# EAGLE design PSoC4Proto_Thermo (EAGLE 7.2.0)
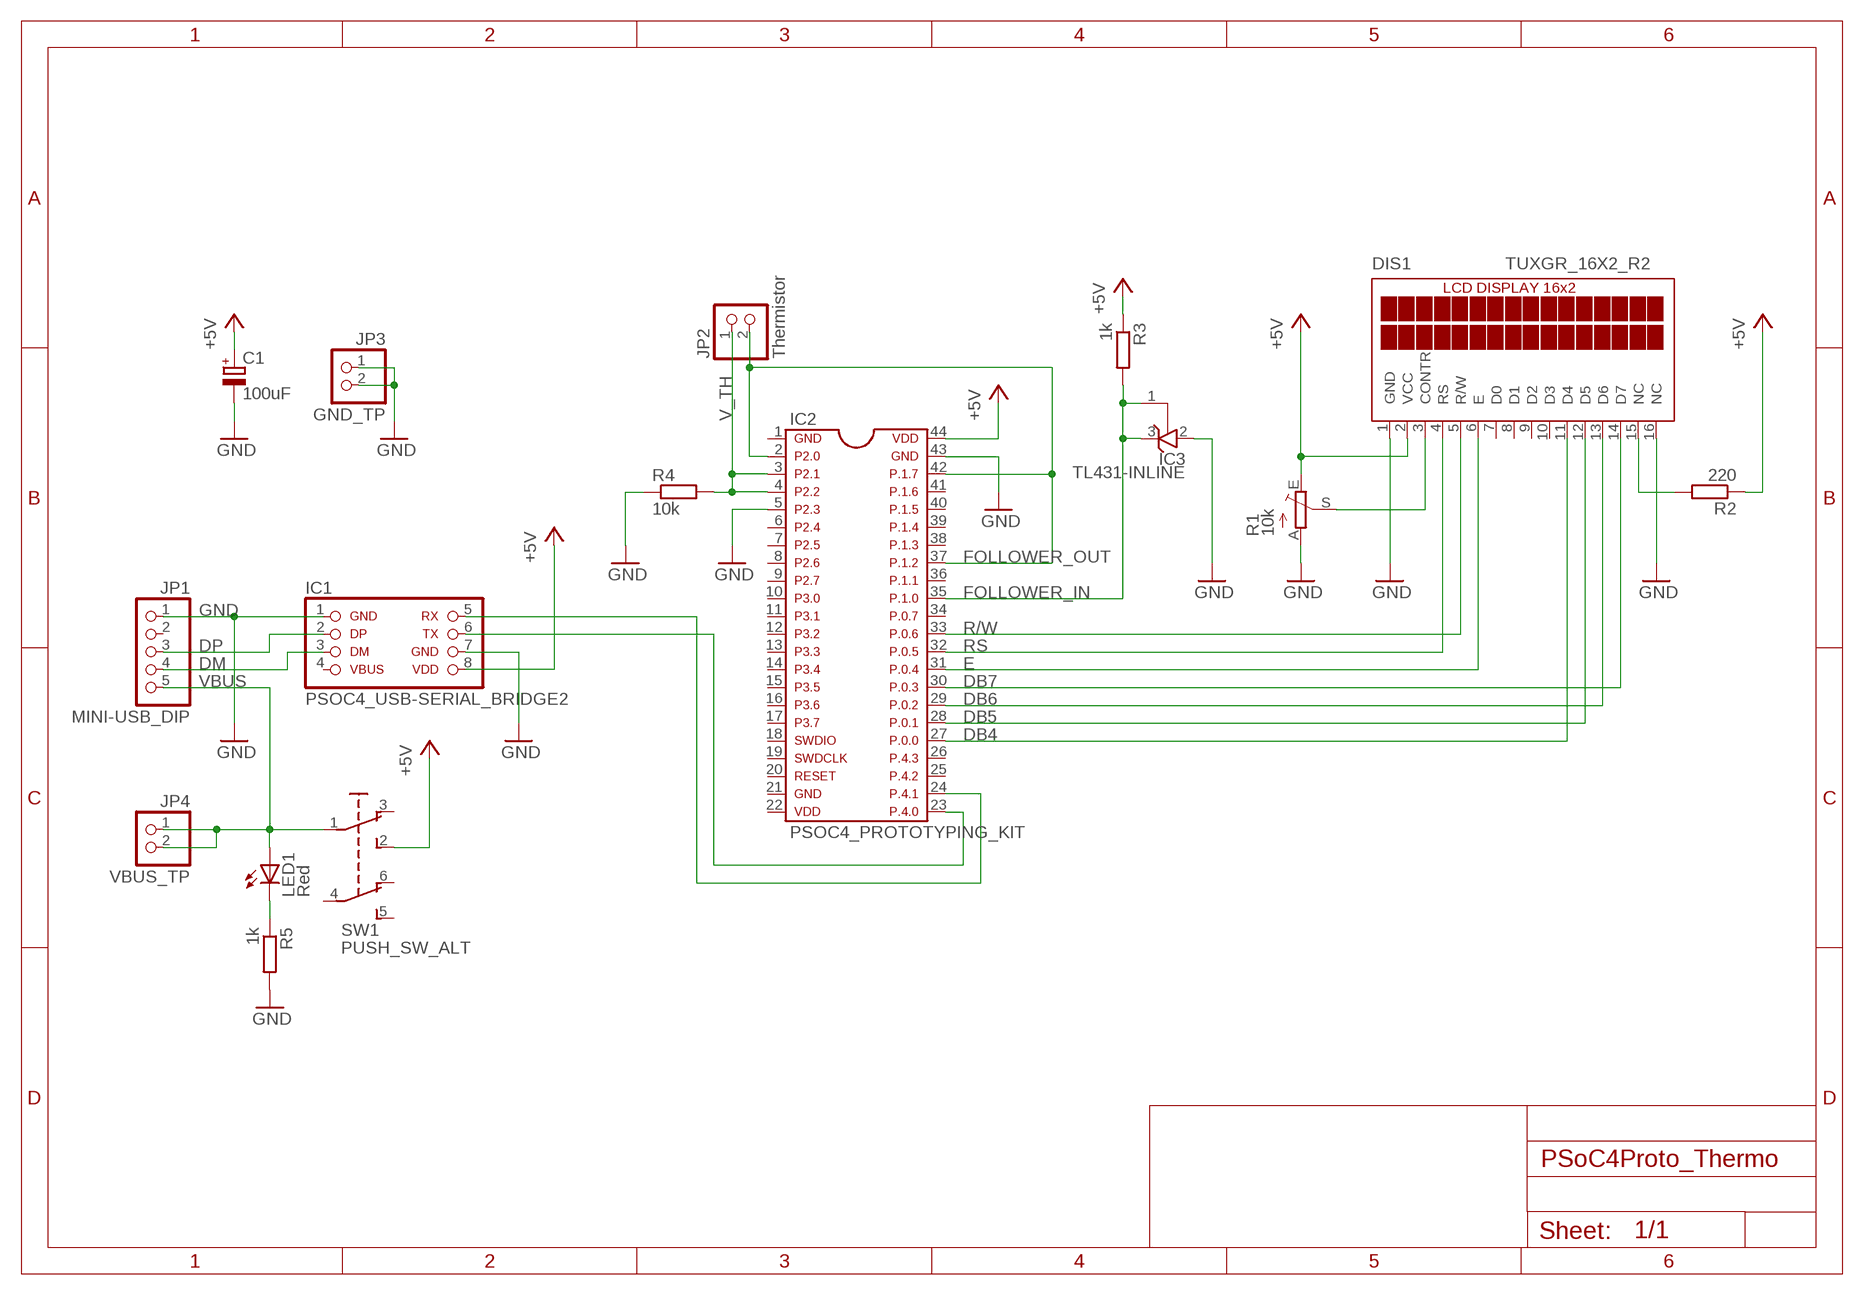
[diagram p0: schematic, sheet 1]

## Parts
C1  100uF  CPOL-EUE2.5-7  [E2,5-7]
DIS1  TUXGR_16X2_R2  [TUXGR_16X2_R2]
IC1  PSOC4_USB-SERIAL_BRIDGE2  [PSOC4-PROTO_USB-SERIAL_BRIDGE]
IC2  PSOC4_PROTOTYPING_KIT  [DIL44-8]
IC3  TL431-INLINE  [TO226AA]
JP1  MINI-USB_DIP  [MINI-USB_DIP]
JP2  Thermistor  PINHD-1X2  [1X02]
JP3  GND_TP  PINHD-1X2  [1X02]
JP4  VBUS_TP  PINHD-1X2  [1X02]
LED1  Red  LED3MM  [LED3MM]
R1  10k  TRIM_EU-B25P  [B25P]
R2  220  R-EU_0207/7  [0207/7]
R3  1k  R-EU_0207/7  [0207/7]
R4  10k  R-EU_0207/7  [0207/7]
R5  1k  R-EU_0207/7  [0207/7]
SW1  PUSH_SW_ALT  [PUSH_SW_ALT]

## Nets
+5V: C1.+ DIS1.2(VCC) IC1.8 IC2.44 R1.E R2.1 R3.1 SW1.2(S)
DB4: DIS1.11(D4) IC2.27
DB5: DIS1.12(D5) IC2.28
DB6: DIS1.13(D6) IC2.29
DB7: DIS1.14(D7) IC2.30
DM: IC1.3 JP1.4
DP: IC1.2 JP1.3
E: DIS1.6(E) IC2.31
FOLLOWER_IN: IC2.35 IC3.1(R) IC3.3(C) R3.2
FOLLOWER_OUT: IC2.2 IC2.37 IC2.42 JP2.2
GND: C1.- DIS1.1(GND) DIS1.16(NC) IC1.1 IC1.7 IC2.5 IC2.43 IC3.2(A) JP1.1 JP3.1 JP3.2 R1.A R4.1 R5.2
N$1: DIS1.15(NC) R2.2
N$2: DIS1.3(CONTR) R1.S
N$3: LED1.K(C) R5.1
R/W: DIS1.5(R/W) IC2.33
RS: DIS1.4(RS) IC2.32
RX: IC1.5 IC2.24
TX: IC1.6 IC2.23
V_TH: IC2.3 IC2.4 JP2.1 R4.2
VBUS: JP1.5 JP4.1 JP4.2 LED1.A SW1.1(P)
Unconnected: DIS1.7(D0) DIS1.8(D1) DIS1.9(D2) DIS1.10(D3) IC1.4 IC2.1 IC2.6 IC2.7 IC2.8 IC2.9 IC2.10 IC2.11 IC2.12 IC2.13 IC2.14 IC2.15 IC2.16 IC2.17 IC2.18 IC2.19 IC2.20 IC2.21 IC2.22 IC2.25 IC2.26 IC2.34 IC2.36 IC2.38 IC2.39 IC2.40 IC2.41 JP1.2 SW1.3(O) SW1.4(P1) SW1.5(S1) SW1.6(O1)

## Library data of the parts
C1 = rcl:CPOL-EU: POLARIZED CAPACITOR, European symbol
DIS1 = display-lcd:TUXGR_16X2_R2: Tuxgraphics LCD display 16x2 characters reflective, without background light Source: tuxgr_12x2_r2.pdf; OC_FARNELL: unknown; OC_NEWARK: unknown
IC1 = mylib2:PSOC4_USB-SERIAL_BRIDGE2
IC2 = mylib2:PSOC4_PROTOTYPING_KIT: Cypress PSoC 4 Prototyping Kit
IC3 = mylib2:TL431-INLINE
JP1 = mylib2:MINI-USB_DIP
JP2-JP4 = pinhead:PINHD-1X2: PIN HEADER
LED1 = led:LED: LED OSRAM: - CHIPLED LG R971, LG N971, LY N971, LG Q971, LY Q971, LO R971, LY R971 LH N974, LH R974 LS Q976, LO Q976, LY Q976 LO Q996 - Hyper CHIPLED LW Q18S LB Q993, LB Q99A, LB R99A - SideLED LS A670, LO A670, LY A670, LG A670, LP A670 LB A673, LV A673, LT A673, LW A673 LH A674 LY A675 LS A676, LA A676, LO A676, LY A676, LW A676 LS A679, LY A679, LG A679 - Hyper Micro SIDELED® LS Y876, LA Y876, LO Y876, LY Y876 LT Y87S - SmartLED LW L88C, LW L88S LB L89C, LB L89S, LG L890 LS L89K, LO L89K, LY L89K LS L896, LA L896, LO L896, LY L896 - TOPLED LS T670, LO T670, LY T670, LG T670, LP T670 LSG T670, LSP T670, LSY T670, LOP T670, LYG T670 LG T671, LOG T671, LSG T671 LB T673, LV T673, LT T673, LW T673 LH T674 LS T676, LA T676, LO T676, LY T676, LB T676, LH T676, LSB T676, LW T676 LB T67C, LV T67C, LT T67C, LS T67K, LO T67K, LY T67K, LW E67C LS E67B, LA E67B, LO E67B, LY E67B, LB E67C, LV E67C, LT E67C LW T67C LS T679, LY T679, LG T679 LS T770, LO T770, LY T770, LG T770, LP T770 LB T773, LV T773, LT T773, LW T773 LH T774 LS E675, LA E675, LY E675, LS T675 LS T776, LA T776, LO T776, LY T776, LB T776 LHGB T686 LT T68C, LB T68C - Hyper Mini TOPLED® LB M676 - Mini TOPLED Santana® LG M470 LS M47K, LO M47K, LY M47K Source: http://www.osram.convergy.de LUXEON: - LUMILED® LXK2-PW12-R00, LXK2-PW12-S00, LXK2-PW14-U00, LXK2-PW14-V00 LXK2-PM12-R00, LXK2-PM12-S00, LXK2-PM14-U00 LXK2-PE12-Q00, LXK2-PE12-R00, LXK2-PE12-S00, LXK2-PE14-T00, LXK2-PE14-U00 LXK2-PB12-K00, LXK2-PB12-L00, LXK2-PB12-M00, LXK2-PB14-N00, LXK2-PB14-P00, LXK2-PB14-Q00 LXK2-PR12-L00, LXK2-PR12-M00, LXK2-PR14-Q00, LXK2-PR14-R00 LXK2-PD12-Q00, LXK2-PD12-R00, LXK2-PD12-S00 LXK2-PH12-R00, LXK2-PH12-S00 LXK2-PL12-P00, LXK2-PL12-Q00, LXK2-PL12-R00 Source: www.luxeon.com KINGBRIGHT: KA-3528ASYC Source: www.kingbright.com
R1 = pot:TRIM_EU-: POTENTIOMETER
R2-R5 = rcl:R-EU_: RESISTOR, European symbol
SW1 = mylib2:PUSH_SW_ALT

## Board
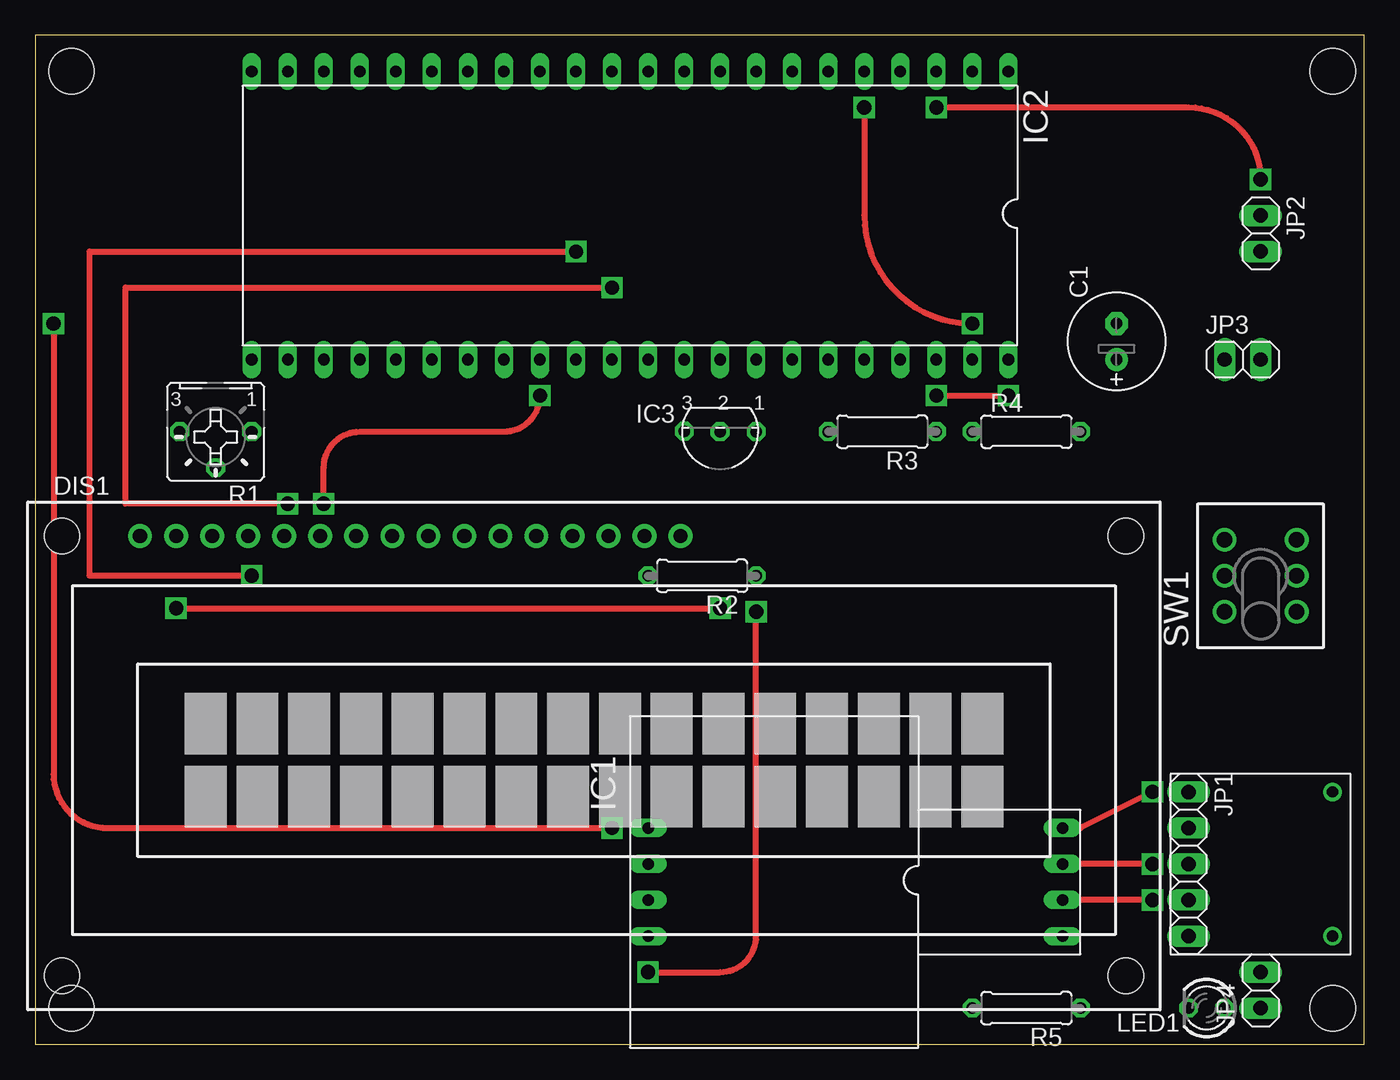
[diagram p1: board, top side]
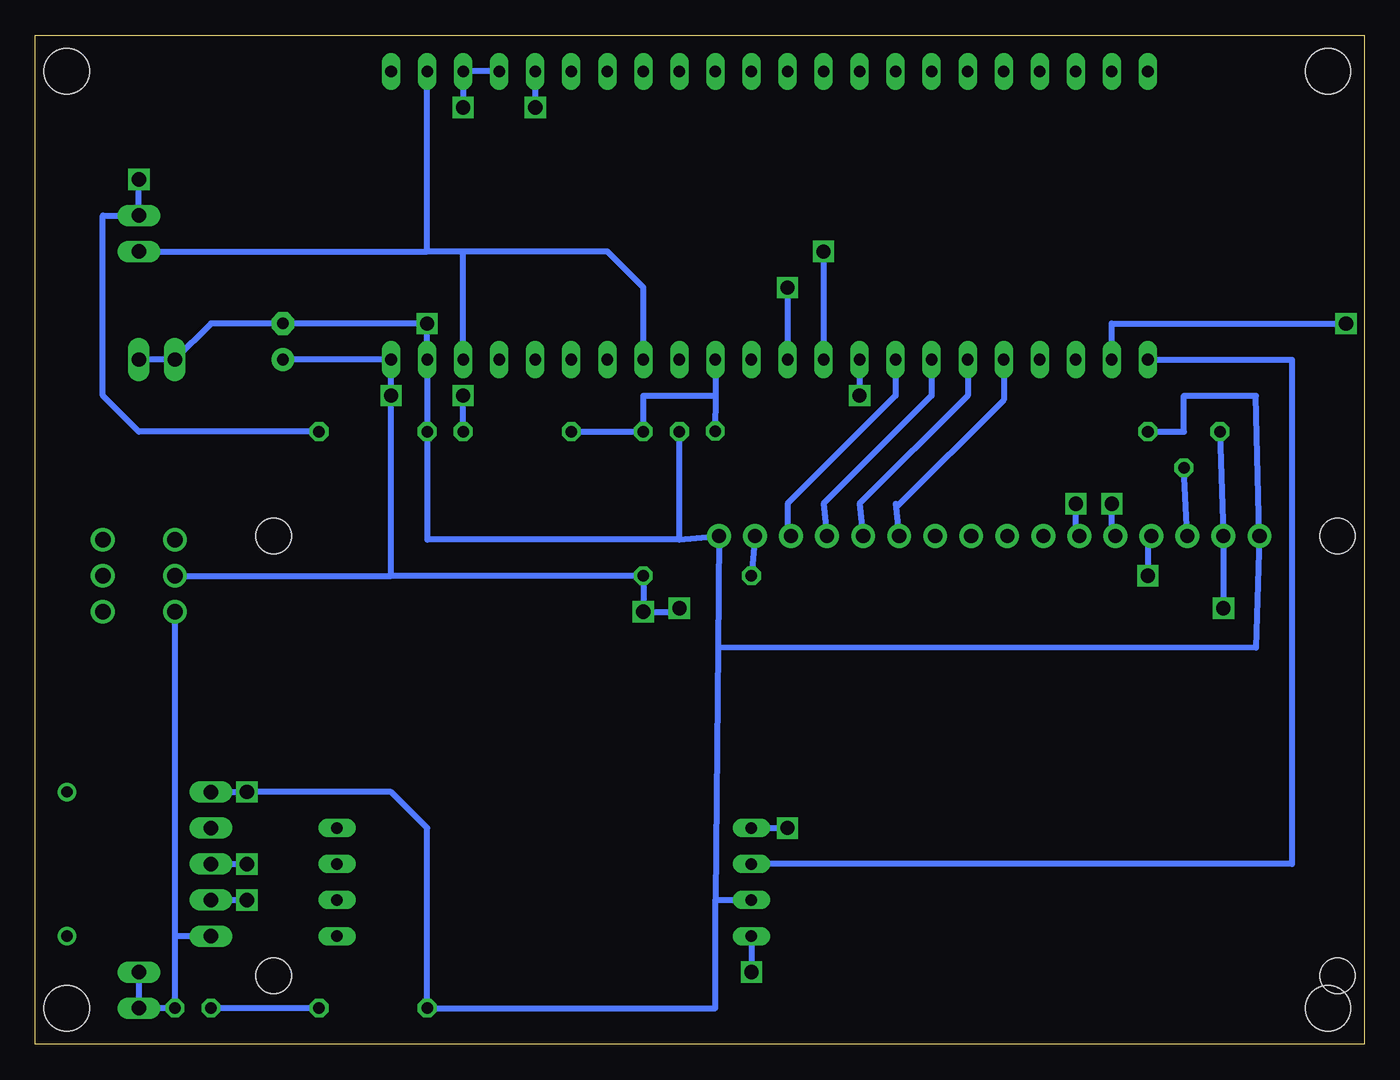
[diagram p2: board, bottom side, seen from below]

Size 93.65 x 71.11 mm. Coordinates in mm from the lower left corner, seen from the top.
Outline: 0,0 93.65,0 93.65,71.11 0,71.11 0,0
Copper layers (1*16): Top 0.035mm / dielectric 1.5mm / Bottom 0.035mm
Design rules "default": minimum track width 10mil, minimum drill 24mil, track to track 8mil, track to pad 8mil, pad to pad 8mil, via to via 8mil, smd to smd 8mil, copper to edge 40mil, drill to drill 8mil, minimum pad ring 10mil, minimum via ring 8mil, stop-mask expansion 4mil, vias tented up to drill 0mil, thermal gap 10mil
Holes 3.2 mm at 2.54,68.58 91.44,68.58 91.44,2.54 2.54,2.54

### Footprints (pad centres in the part's own frame; a part is rotated, then mirrored left to right if it is on the bottom)
E2,5-7 = drill 0.813 pad 1.6: + -1.27,0 | drill 0.813 pad 1.6 octagon: - 1.27,0
TUXGR_16X2_R2 = drill 1 pad 1.676: 1 -32,15.5; 2 -29.46,15.5; 3 -26.92,15.5; 4 -24.38,15.5; 5 -21.84,15.5; 6 -19.3,15.5; 7 -16.76,15.5; 8 -14.22,15.5; 9 -11.68,15.5; 10 -9.14,15.5; 11 -6.6,15.5; 12 -4.06,15.5; 13 -1.52,15.5; 14 1.02,15.5; 15 3.56,15.5; 16 6.1,15.5 | hole 2.5: -37.5,-15.5; 37.5,-15.5; -37.5,15.5; 37.5,15.5
PSOC4-PROTO_USB-SERIAL_BRIDGE = drill 0.813 long: 1 -21.59,-3.81; 2 -21.59,-1.27; 3 -21.59,1.27; 4 -21.59,3.81; 5 7.62,-3.81; 6 7.62,-1.27; 7 7.62,1.27; 8 7.62,3.81
DIL44-8 = drill 0.813 long: 1 -26.67,-7.62; 2 -24.13,-7.62; 3 -21.59,-7.62; 4 -19.05,-7.62; 5 -16.51,-7.62; 6 -13.97,-7.62; 7 -11.43,-7.62; 8 -8.89,-7.62; 9 -6.35,-7.62; 10 -3.81,-7.62; 11 -1.27,-7.62; 12 1.27,-7.62; 13 3.81,-7.62; 14 6.35,-7.62; 15 8.89,-7.62; 16 11.43,-7.62; 17 13.97,-7.62; 18 16.51,-7.62; 19 19.05,-7.62; 20 21.59,-7.62; 21 24.13,-7.62; 22 26.67,-7.62; 23 26.67,12.7; 24 24.13,12.7; 25 21.59,12.7; 26 19.05,12.7; 27 16.51,12.7; 28 13.97,12.7; 29 11.43,12.7; 30 8.89,12.7; 31 6.35,12.7; 32 3.81,12.7; 33 1.27,12.7; 34 -1.27,12.7; 35 -3.81,12.7; 36 -6.35,12.7; 37 -8.89,12.7; 38 -11.43,12.7; 39 -13.97,12.7; 40 -16.51,12.7; 41 -19.05,12.7; 42 -21.59,12.7; 43 -24.13,12.7; 44 -26.67,12.7
TO226AA = drill 0.813 octagon: 1 -2.544,0; 2 0.001,0; 3 2.524,-0.04
MINI-USB_DIP = drill 1.016 long: 1 -5.08,0; 2 -2.54,0; 3 0,0; 4 2.54,0; 5 5.08,0 | drill 0.8: P$1 -5.08,10.16; P$2 5.08,10.16
1X02 = drill 1.016 long: 1 -1.27,0; 2 1.27,0
LED3MM = drill 0.813 octagon: A -1.27,0; K 1.27,0
B25P = drill 0.813 octagon: A -2.54,0; E 2.54,0; S 0,2.54
0207/7 = drill 0.813 octagon: 1 -3.81,0; 2 3.81,0
PUSH_SW_ALT = drill 1.1 pad 1.676: 1 -2.54,2.54; 2 0,2.54; 3 2.54,2.54; 4 -2.54,-2.54; 5 0,-2.54; 6 2.54,-2.54

### Placement (x,y rotation side)
C1  76.2,49.53 90 top
DIS1  39.37,20.32 0 top
IC1  50.8,11.43 180 top
IC2  41.91,60.96 180 top
IC3  48.26,43.18 180 top
JP1  81.28,12.7 270 top
JP2  86.36,57.15 270 top
JP3  85.09,48.26 0 top
JP4  86.36,3.81 90 top
LED1  82.55,2.54 180 top
R1  12.7,43.18 180 top
R2  46.99,33.02 180 top
R3  59.69,43.18 180 top
R4  69.85,43.18 0 top
R5  69.85,2.54 180 top
SW1  86.36,33.02 90 top

### Tracks (layer width: path | path; a pad name or v marks a point on that pad's centre or on a via)
+5V  (via drill 1)
  Top 0.406: v63.5,45.72 v68.58,45.72 | v43.18,5.08 48.26,5.08 arc90 50.8,7.62 v50.8,30.48 | v9.91,30.73 v48.26,30.73
  Bottom 0.406: R1.E DIS1.2 v9.91,30.73 | 68.58,33.02 R2.1 v50.8,30.48 48.51,30.48 arc-90 v48.26,30.73 | 68.58,33.02 v68.58,45.72 IC2.44 C1.+ | R3.1 v63.5,45.72 | IC1.8 v43.18,5.08 | SW1.2 68.58,33.02
DB4
  Bottom 0.406: 33.02,38.1 32.99,37.83 | 32.99,37.83 DIS1.11 | IC2.27 25.4,45.41 32.99,37.83
DB5
  Bottom 0.406: DIS1.12 35.56,38.1 27.94,45.72 IC2.28
DB6
  Bottom 0.406: DIS1.13 38.1,38.1 30.48,45.72 IC2.29
DB7
  Bottom 0.406: IC2.30 33.02,45.72 40.64,38.1 40.64,36.07 DIS1.14
DM  (via drill 1)
  Top 0.406: v78.74,10.16 IC1.3
  Bottom 0.406: JP1.4 v78.74,10.16
DP  (via drill 1)
  Top 0.406: v78.74,12.7 IC1.2
  Bottom 0.406: JP1.3 v78.74,12.7
E  (via drill 1)
  Top 0.406: v35.56,45.72 arc-90 33.02,43.18 22.86,43.18 arc90 20.32,40.64 v20.32,38.1
  Bottom 0.406: DIS1.6 20.32,35.82 v20.32,38.1 | IC2.31 v35.56,45.72
FOLLOWER_IN
  Bottom 0.406: IC2.35 45.73,45.71 | 45.73,45.71 IC3.3 | 45.73,45.71 50.8,45.72 IC3.1 R3.2
FOLLOWER_OUT
  Bottom 0.406: JP2.2 66.04,55.88 | 66.04,55.88 IC2.2 | IC2.37 50.8,53.34 53.34,55.88 63.5,55.88 | 63.5,55.88 66.04,55.88 | IC2.42 63.5,55.88
GND  (via drill 1)
  Top 0.406: v78.74,17.78 73.66,15.24 IC1.1 | v58.42,66.04 58.42,58.42 arc90 v66.04,50.8
  Bottom 0.406: R1.A 12.7,43.18 12.7,45.72 7.62,45.72 DIS1.1 7.62,27.94 45.52,27.96 | 45.52,27.96 DIS1.16 48.26,35.56 | 45.52,27.96 45.72,10.16 | 45.72,10.16 IC1.7 | 45.72,10.16 45.72,2.54 R5.2 66.04,15.24 68.58,17.78 v78.74,17.78 JP1.1 | 48.26,35.56 66.04,35.56 R4.1 IC2.43 v66.04,50.8 C1.- 81.28,50.8 JP3.1 JP3.2 | 48.26,35.56 IC3.2 | IC2.5 v58.42,66.04
N$1
  Bottom 0.406: DIS1.15 R2.2
N$2
  Bottom 0.406: DIS1.3 R1.S
N$3
  Bottom 0.406: R5.1 LED1.K
R/W  (via drill 1)
  Top 0.406: v17.78,38.1 6.35,38.1 6.35,53.34 v40.64,53.34
  Bottom 0.406: DIS1.5 17.78,35.82 v17.78,38.1 | v40.64,53.34 IC2.33
RS  (via drill 1)
  Top 0.406: v15.24,33.02 3.81,33.02 3.81,55.88 v38.1,55.88
  Bottom 0.406: DIS1.4 15.24,35.82 v15.24,33.02 | v38.1,55.88 IC2.32
RX  (via drill 1)
  Top 0.406: v1.27,50.8 1.27,19.05 arc90 5.08,15.24 v40.64,15.24
  Bottom 0.406: IC2.24 17.78,50.8 v1.27,50.8 | IC1.5 v40.64,15.24
TX
  Bottom 0.406: IC2.23 5.08,48.26 5.08,12.7 IC1.6
V_TH  (via drill 1)
  Top 0.406: v63.5,66.04 81.28,66.04 arc-90 v86.36,60.96
  Bottom 0.406: IC2.4 IC2.3 v63.5,66.04 | v86.36,60.96 JP2.1 88.9,58.42 88.9,45.72 86.36,43.18 R4.2
VBUS
  Bottom 0.406: JP1.5 83.82,7.62 | 83.82,7.62 LED1.A JP4.1 JP4.2 | SW1.1 83.82,7.62

### Text on the board
tDocu: SWの方向に注意